# Altium project FiltroHPFinal.PrjPcb
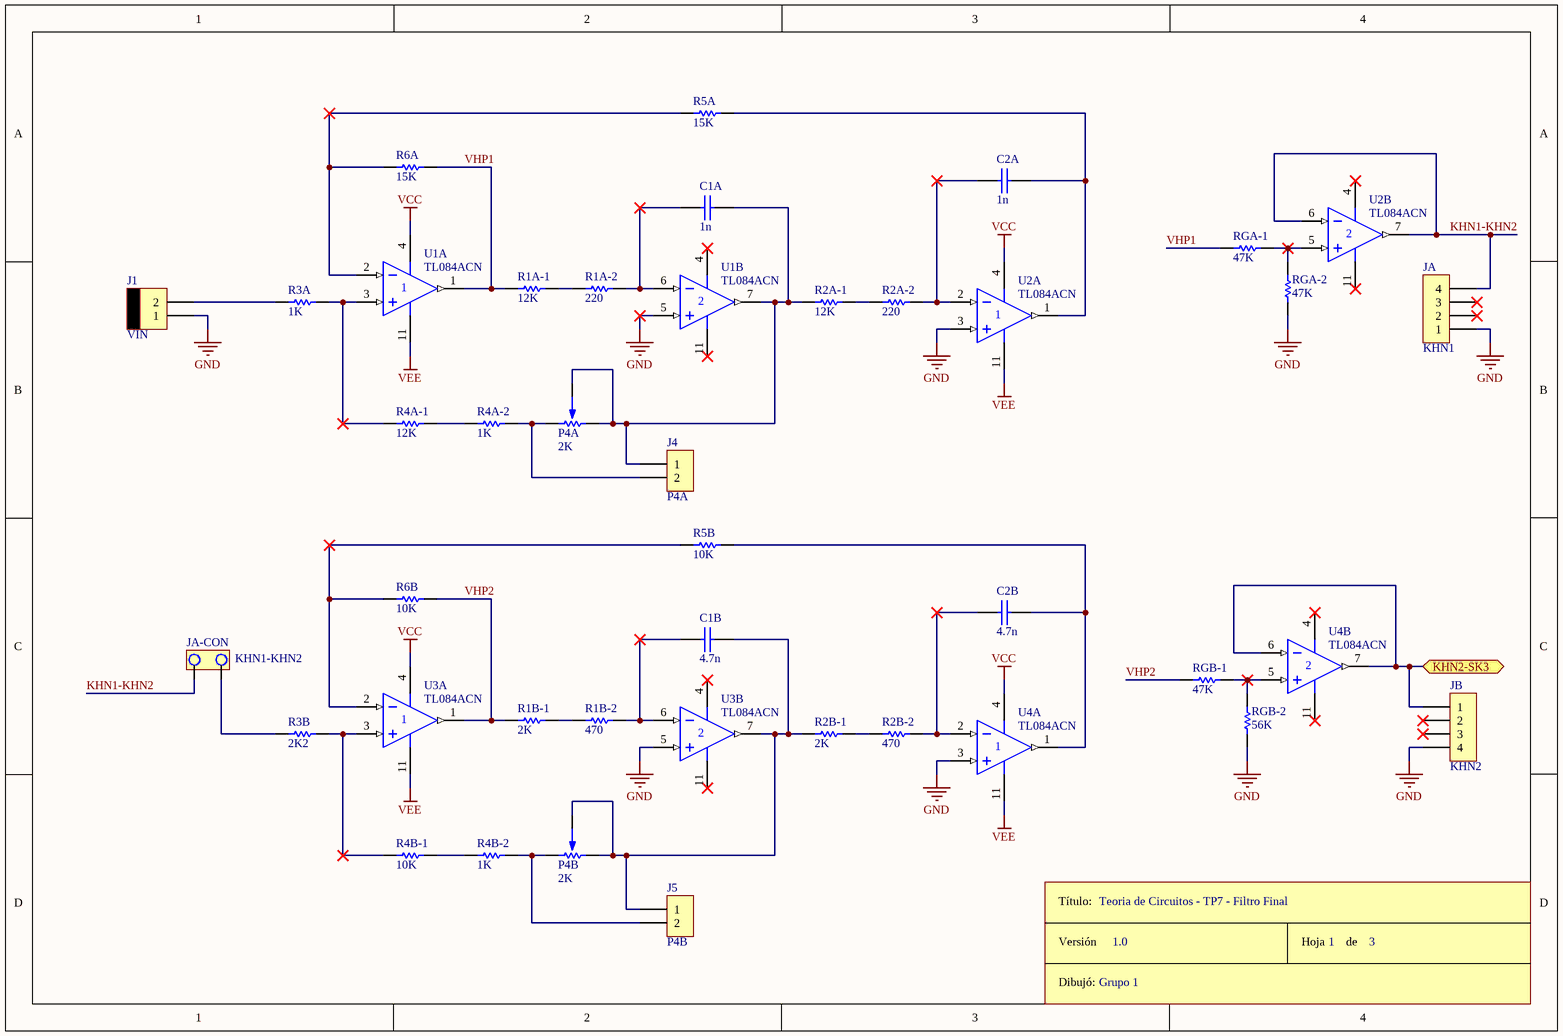
[diagram p0: Etapas_Parte1.SchDoc]
3 sheets, 101 parts. Net scope: flat (ports and power ports of the same name join across sheets).
Board file: PlacaFiltroFinal.PcbDoc
Sheets:
  Etapas_Parte1.SchDoc
  Etapas_Parte2.SchDoc
  ConectoresAdicionales.SchDoc

## Sheet Etapas_Parte1.SchDoc
size A4

### Parts
C1A  1n  [CAP200]
C1B  4.7n  [CAP200]
C2A  1n  [CAP200]
C2B  4.7n  [CAP200]
J1  VIN  [MOLEX2]
J4  P4A  [SIP2]
J5  P4B  [SIP2]
JA  KHN1  [SIP4]
JA-CON  KHN1-KHN2  [JUMPER2]
JB  KHN2  [SIP4]
P4A  2K  [PRESET V]
P4B  2K  [PRESET V]
R1A-1  12K  [RES400]
R1A-2  220  [RES400]
R1B-1  2K  [RES400]
R1B-2  470  [RES400]
R2A-1  12K  [RES400]
R2A-2  220  [RES400]
R2B-1  2K  [RES400]
R2B-2  470  [RES400]
R3A  1K  [RES400]
R3B  2K2  [RES400]
R4A-1  12K  [RES400]
R4A-2  1K  [RES400]
R4B-1  10K  [RES400]
R4B-2  1K  [RES400]
R5A  15K  [RES400]
R5B  10K  [RES400]
R6A  15K  [RES400]
R6B  10K  [RES400]
RGA-1  47K  [RES400]
RGA-2  47K  [RES400]
RGB-1  47K  [RES400]
RGB-2  56K  [RES400]
ROT1  Rótulo  (value not drawn)
U1  TL084ACN  [646-06]  (parts A,B of 4)
U2  TL084ACN  [646-06]  (parts A,B of 4)
U3  TL084ACN  [646-06]  (parts A,B of 4)
U4  TL084ACN  [646-06]  (parts A,B of 4)

### Ports
KHN2-SK3

### Nets
GND: J1.1 JA.1 JB.4 RGA-2.1 RGB-2.1 U1.5(IN+) U2.3(IN+) U3.5(IN+) U4.3(IN+)
VCC: U1.4(V+) U2.4(V+) U3.4(V+) U4.4(V+)
VEE: U1.11(V-) U2.11(V-) U3.11(V-) U4.11(V-)
KHN1-KHN2: JA.4 JA-CON.2 U2.6(IN-) U2.7(OUT)
VHP1: R1A-1.1 R6A.2 RGA-1.1 U1.1(OUT)
VHP2: R1B-1.1 R6B.2 RGB-1.1 U3.1(OUT)
NetC1A_1: C1A.1 R1A-2.2 U1.6(IN-)
NetC1A_2: C1A.2 J4.1 P4A.2 P4A.3 R2A-1.1 U1.7(OUT)
NetC1B_1: C1B.1 R1B-2.2 U3.6(IN-)
NetC1B_2: C1B.2 J5.1 P4B.2 P4B.3 R2B-1.1 U3.7(OUT)
NetC2A_1: C2A.1 R2A-2.2 U2.2(IN-)
NetC2A_2: C2A.2 R5A.2 U2.1(OUT)
NetC2B_1: C2B.1 R2B-2.2 U4.2(IN-)
NetC2B_2: C2B.2 R5B.2 U4.1(OUT)
NetJ1_2: J1.2 R3A.1
NetJ4_2: J4.2 P4A.1 R4A-2.2
NetJ5_2: J5.2 P4B.1 R4B-2.2
NetJA-CON_1: JA-CON.1 R3B.2
NetJB_1: JB.1 U4.6(IN-) U4.7(OUT) ; port KHN2-SK3
NetR1A-1_2: R1A-1.2 R1A-2.1
NetR1B-1_2: R1B-1.2 R1B-2.1
NetR2A-1_2: R2A-1.2 R2A-2.1
NetR2B-1_2: R2B-1.2 R2B-2.1
NetR3A_2: R3A.2 R4A-1.1 U1.3(IN+)
NetR3B_1: R3B.1 R4B-1.1 U3.3(IN+)
NetR4A-1_2: R4A-1.2 R4A-2.1
NetR4B-1_2: R4B-1.2 R4B-2.1
NetR5A_1: R5A.1 R6A.1 U1.2(IN-)
NetR5B_1: R5B.1 R6B.1 U3.2(IN-)
NetRGA-1_2: RGA-1.2 RGA-2.2 U2.5(IN+)
NetRGB-1_2: RGB-1.2 RGB-2.2 U4.5(IN+)

Not connected (* = marked no-connect by the designer): JA 2* 3*; JB 2* 3*

### Notes on the sheet
- Teoria de Circuitos - TP7 - Filtro Final
- Grupo 1
- 1.0
- 1
- 3
- (in symbol Rótulo) Título:; Versión; Hoja       de; Dibujó:

### Library data of the parts
C1A C1B C2A C2B = CAP
J1 = MOLEX2
J4 J5 = CON2
JA JB = CON4
JA-CON = JUMPER
P4A P4B = PRESET
R1A-1 R1A-2 R1B-1 R1B-2 R2A-1 R2A-2 R2B-1 R2B-2 R3A R3B R4A-1 R4A-2 R4B-1 R4B-2 R5A R5B R6A R6B RGA-1 RGA-2 RGB-1 RGB-2 = RES
U1-U4 = TL084ACN: JFET-Input Operational Amplifier; Published: 17-Jul-2002; LatestRevisionDate: 06-Jun-2005; LatestRevisionNote: Stylized 3D Model Added.; DatasheetVersion: 1988; PackageVersion: 1997; PackageReference: 646-06; Publisher: Altium Limited; PackageDescription: DIP; 14 Leads; Row Spacing 7.62 mm; Pitch 2.54 mm; ComponentLink1Description: Manufacturer Link; ComponentLink1URL: http://www.onsemi.com/site/products/parametrics/0,4446,251,00.html

## Sheet Etapas_Parte2.SchDoc
size A4
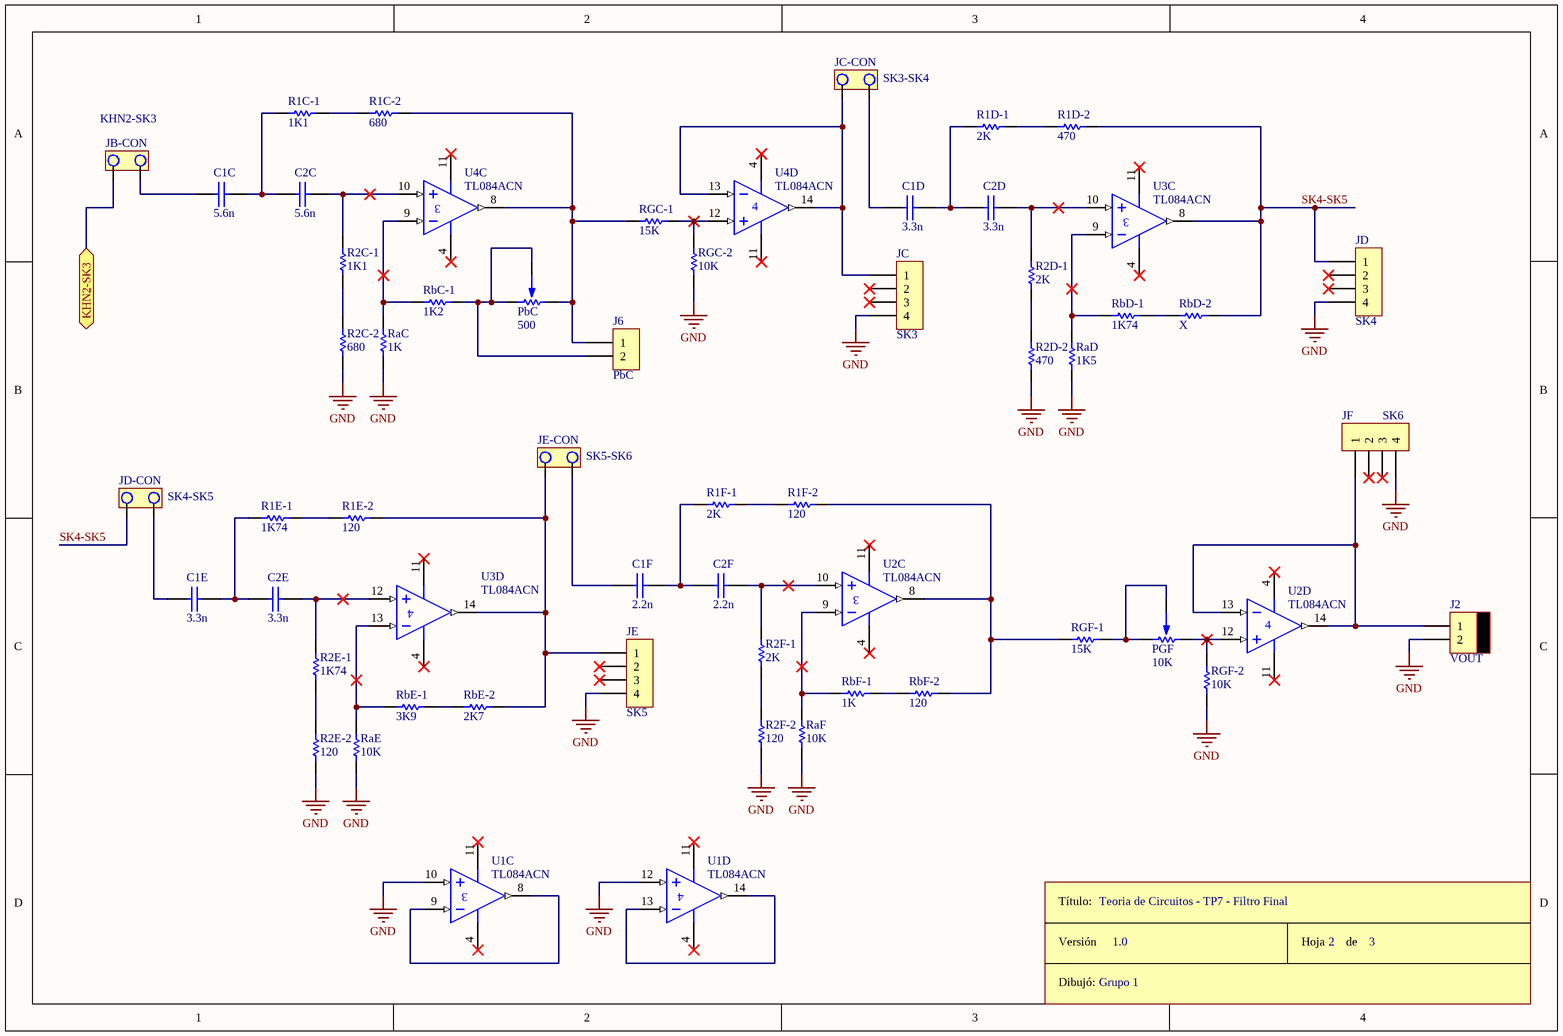
[diagram p1: Etapas_Parte2.SchDoc]

### Parts
C1C  5.6n  [CAP200]
C1D  3.3n  [CAP200]
C1E  3.3n  [CAP200]
C1F  2.2n  [CAP200]
C2C  5.6n  [CAP200]
C2D  3.3n  [CAP200]
C2E  3.3n  [CAP200]
C2F  2.2n  [CAP200]
J2  VOUT  [MOLEX2]
J6  PbC  [SIP2]
JB-CON  KHN2-SK3  [JUMPER2]
JC  SK3  [SIP4]
JC-CON  SK3-SK4  [JUMPER2]
JD  SK4  [SIP4]
JD-CON  SK4-SK5  [JUMPER2]
JE  SK5  [SIP4]
JE-CON  SK5-SK6  [JUMPER2]
JF  SK6  [SIP4]
PbC  500  [PRESET V]
PGF  10K  [PRESET V]
R1C-1  1K1  [RES400]
R1C-2  680  [RES400]
R1D-1  2K  [RES400]
R1D-2  470  [RES400]
R1E-1  1K74  [RES400]
R1E-2  120  [RES400]
R1F-1  2K  [RES400]
R1F-2  120  [RES400]
R2C-1  1K1  [RES400]
R2C-2  680  [RES400]
R2D-1  2K  [RES400]
R2D-2  470  [RES400]
R2E-1  1K74  [RES400]
R2E-2  120  [RES400]
R2F-1  2K  [RES400]
R2F-2  120  [RES400]
RaC  1K  [RES400]
RaD  1K5  [RES400]
RaE  10K  [RES400]
RaF  10K  [RES400]
RbC-1  1K2  [RES400]
RbD-1  1K74  [RES400]
RbD-2  X  [RES400]
RbE-1  3K9  [RES400]
RbE-2  2K7  [RES400]
RbF-1  1K  [RES400]
RbF-2  120  [RES400]
RGC-1  15K  [RES400]
RGC-2  10K  [RES400]
RGF-1  15K  [RES400]
RGF-2  10K  [RES400]
ROT2  Rótulo  (value not drawn)
U1  TL084ACN  [646-06]  (parts C,D of 4)
U2  TL084ACN  [646-06]  (parts C,D of 4)
U3  TL084ACN  [646-06]  (parts C,D of 4)
U4  TL084ACN  [646-06]  (parts C,D of 4)

### Ports
KHN2-SK3

### Nets
GND: J2.2 JC.4 JD.4 JE.4 JF.4 R2C-2.1 R2D-2.1 R2E-2.1 R2F-2.1 RaC.1 RaD.1 RaE.1 RaF.1 RGC-2.1 RGF-2.1 U1.10(IN+) U1.12(IN+)
VCC: U1.4(V+) U2.4(V+) U3.4(V+) U4.4(V+)
VEE: U1.11(V-) U2.11(V-) U3.11(V-) U4.11(V-)
SK4-SK5: JD.1 JD-CON.2 R1D-2.2 RbD-2.2 U3.8(OUT)
NetC1C_1: C1C.1 JB-CON.1
NetC1C_2: C1C.2 C2C.1 R1C-1.1
NetC1D_1: C1D.1 JC-CON.1
NetC1D_2: C1D.2 C2D.1 R1D-1.1
NetC1E_1: C1E.1 JD-CON.1
NetC1E_2: C1E.2 C2E.1 R1E-1.1
NetC1F_1: C1F.1 JE-CON.1
NetC1F_2: C1F.2 C2F.1 R1F-1.1
NetC2C_2: C2C.2 R2C-1.2 U4.10(IN+)
NetC2D_2: C2D.2 R2D-1.2 U3.10(IN+)
NetC2E_2: C2E.2 R2E-1.2 U3.12(IN+)
NetC2F_2: C2F.2 R2F-1.2 U2.10(IN+)
NetJ2_1: J2.1 JF.1 U2.13(IN-) U2.14(OUT)
NetJ6_1: J6.1 PbC.3 R1C-2.2 RGC-1.1 U4.8(OUT)
NetJ6_2: J6.2 PbC.1 PbC.2 RbC-1.1
NetJB_1: JB-CON.2 ; port KHN2-SK3
NetJC_1: JC.1 JC-CON.2 U4.13(IN-) U4.14(OUT)
NetJE_1: JE.1 JE-CON.2 R1E-2.2 RbE-2.2 U3.14(OUT)
NetPGF_1: PGF.1 PGF.2 RGF-1.1
NetPGF_3: PGF.3 RGF-2.2 U2.12(IN+)
NetR1C-1_2: R1C-1.2 R1C-2.1
NetR1D-1_2: R1D-1.2 R1D-2.1
NetR1E-1_2: R1E-1.2 R1E-2.1
NetR1F-1_2: R1F-1.2 R1F-2.1
NetR1F-2_2: R1F-2.2 RbF-2.2 RGF-1.2 U2.8(OUT)
NetR2C-1_1: R2C-1.1 R2C-2.2
NetR2D-1_1: R2D-1.1 R2D-2.2
NetR2E-1_1: R2E-1.1 R2E-2.2
NetR2F-1_1: R2F-1.1 R2F-2.2
NetRaC_2: RaC.2 RbC-1.2 U4.9(IN-)
NetRaD_2: RaD.2 RbD-1.2 U3.9(IN-)
NetRaE_2: RaE.2 RbE-1.2 U3.13(IN-)
NetRaF_2: RaF.2 RbF-1.2 U2.9(IN-)
NetRbD-1_1: RbD-1.1 RbD-2.1
NetRbE-1_1: RbE-1.1 RbE-2.1
NetRbF-1_1: RbF-1.1 RbF-2.1
NetRGC-1_2: RGC-1.2 RGC-2.2 U4.12(IN+)
NetU1_8: U1.8(OUT) U1.9(IN-)
NetU1_13: U1.13(IN-) U1.14(OUT)

Not connected (* = marked no-connect by the designer): JC 2* 3*; JD 2* 3*; JE 2* 3*; JF 2* 3*

### Notes on the sheet
- Teoria de Circuitos - TP7 - Filtro Final
- Grupo 1
- 1.0
- 2
- 3
- (in symbol Rótulo) Título:; Versión; Hoja       de; Dibujó:

### Library data of the parts
C1C C1D C1E C1F C2C C2D C2E C2F = CAP
J2 = MOLEX2
J6 = CON2
JB-CON JC-CON JD-CON JE-CON = JUMPER
JC JD JE JF = CON4
PbC PGF = PRESET
R1C-1 R1C-2 R1D-1 R1D-2 R1E-1 R1E-2 R1F-1 R1F-2 R2C-1 R2C-2 R2D-1 R2D-2 R2E-1 R2E-2 R2F-1 R2F-2 RaC RaD RaE RaF RbC-1 RbD-1 RbD-2 RbE-1 RbE-2 RbF-1 RbF-2 RGC-1 RGC-2 RGF-1 RGF-2 = RES
U1-U4 = TL084ACN: JFET-Input Operational Amplifier; Published: 17-Jul-2002; LatestRevisionDate: 06-Jun-2005; LatestRevisionNote: Stylized 3D Model Added.; DatasheetVersion: 1988; PackageVersion: 1997; PackageReference: 646-06; Publisher: Altium Limited; PackageDescription: DIP; 14 Leads; Row Spacing 7.62 mm; Pitch 2.54 mm; ComponentLink1Description: Manufacturer Link; ComponentLink1URL: http://www.onsemi.com/site/products/parametrics/0,4446,251,00.html

## Sheet ConectoresAdicionales.SchDoc
size A4
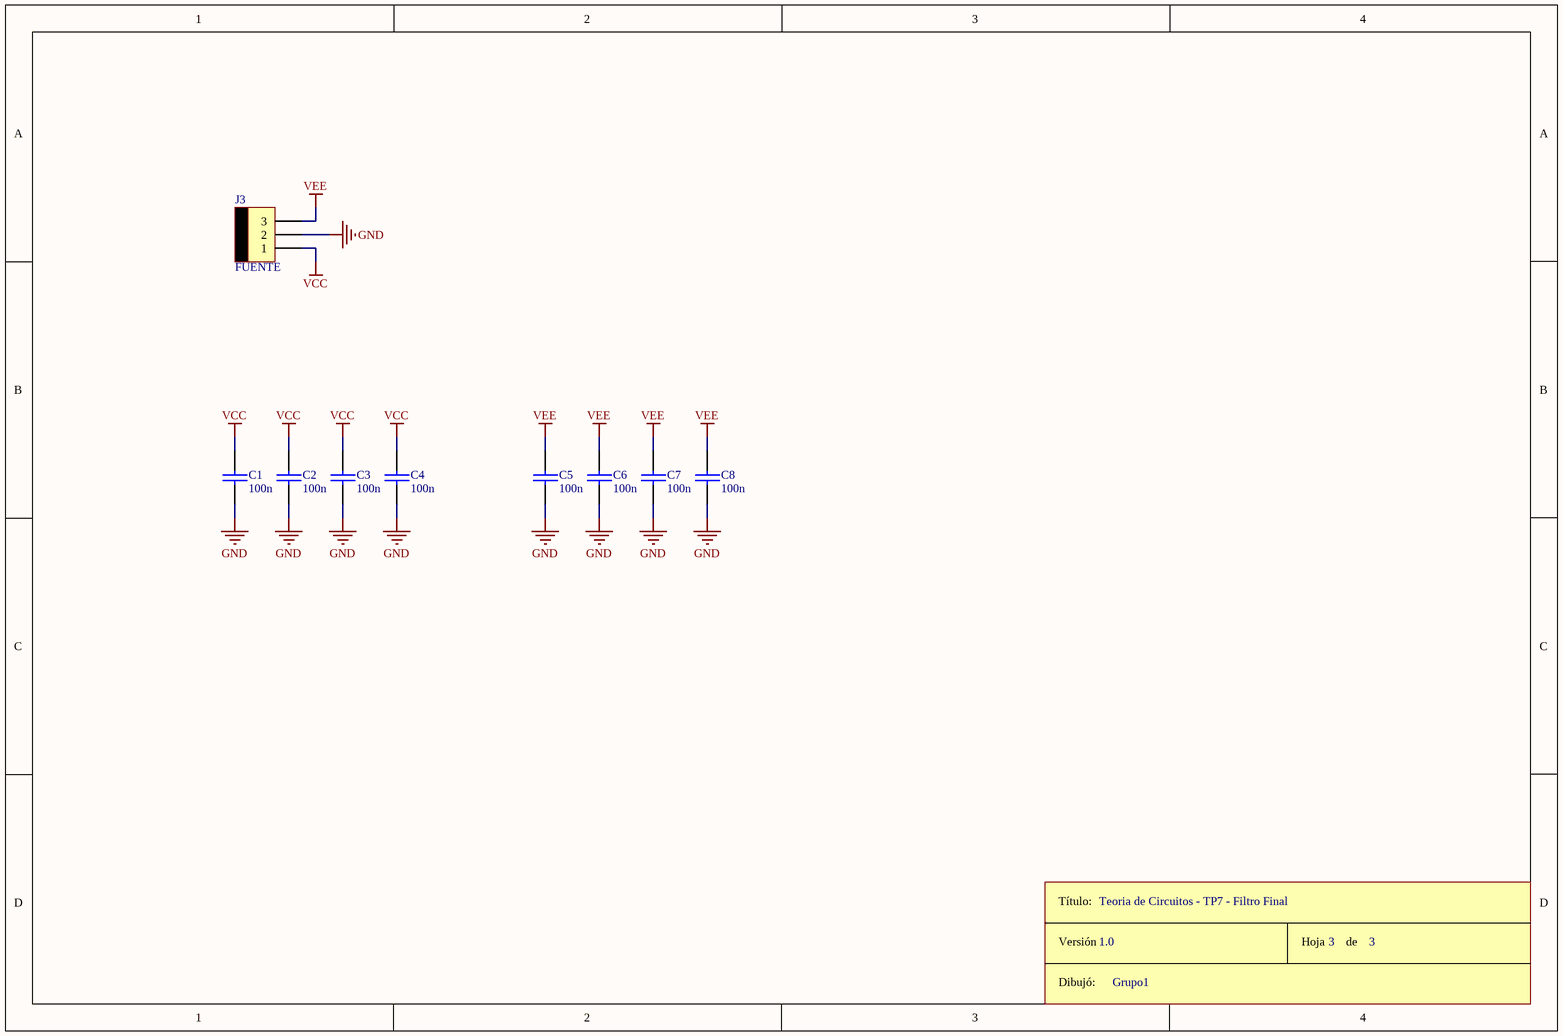
[diagram p2: ConectoresAdicionales.SchDoc]

### Parts
C1  100n  [CAP100]
C2  100n  [CAP100]
C3  100n  [CAP100]
C4  100n  [CAP100]
C5  100n  [CAP100]
C6  100n  [CAP100]
C7  100n  [CAP100]
C8  100n  [CAP100]
J3  FUENTE  [MOLEX3]
ROT3  Rótulo  (value not drawn)

### Nets
GND: C1.2 C2.2 C3.2 C4.2 C5.2 C6.2 C7.2 C8.2 J3.2
VCC: C1.1 C2.1 C3.1 C4.1 J3.1
VEE: C5.1 C6.1 C7.1 C8.1 J3.3

### Notes on the sheet
- Teoria de Circuitos - TP7 - Filtro Final
- 1.0
- Grupo1
- 3
- (in symbol Rótulo) Título:; Versión; Hoja       de; Dibujó:

### Library data of the parts
C1-C8 = CAP
J3 = MOLEX3

## Nets that join several sheets
GND: Etapas_Parte1 (9 pins), Etapas_Parte2 (17 pins), ConectoresAdicionales (9 pins)
VCC: Etapas_Parte1 (U1.4 U2.4 U3.4 U4.4), Etapas_Parte2 (U1.4 U2.4 U3.4 U4.4), ConectoresAdicionales (5 pins)
VEE: Etapas_Parte1 (U1.11 U2.11 U3.11 U4.11), Etapas_Parte2 (U1.11 U2.11 U3.11 U4.11), ConectoresAdicionales (5 pins)
NetJB_1: Etapas_Parte1 (JB.1 U4.6 U4.7), Etapas_Parte2 (JB-CON.2)